# Altium schematic sheet Sheet2.SchDoc
size A3; SheetNumber: 2; SheetTotal: 2
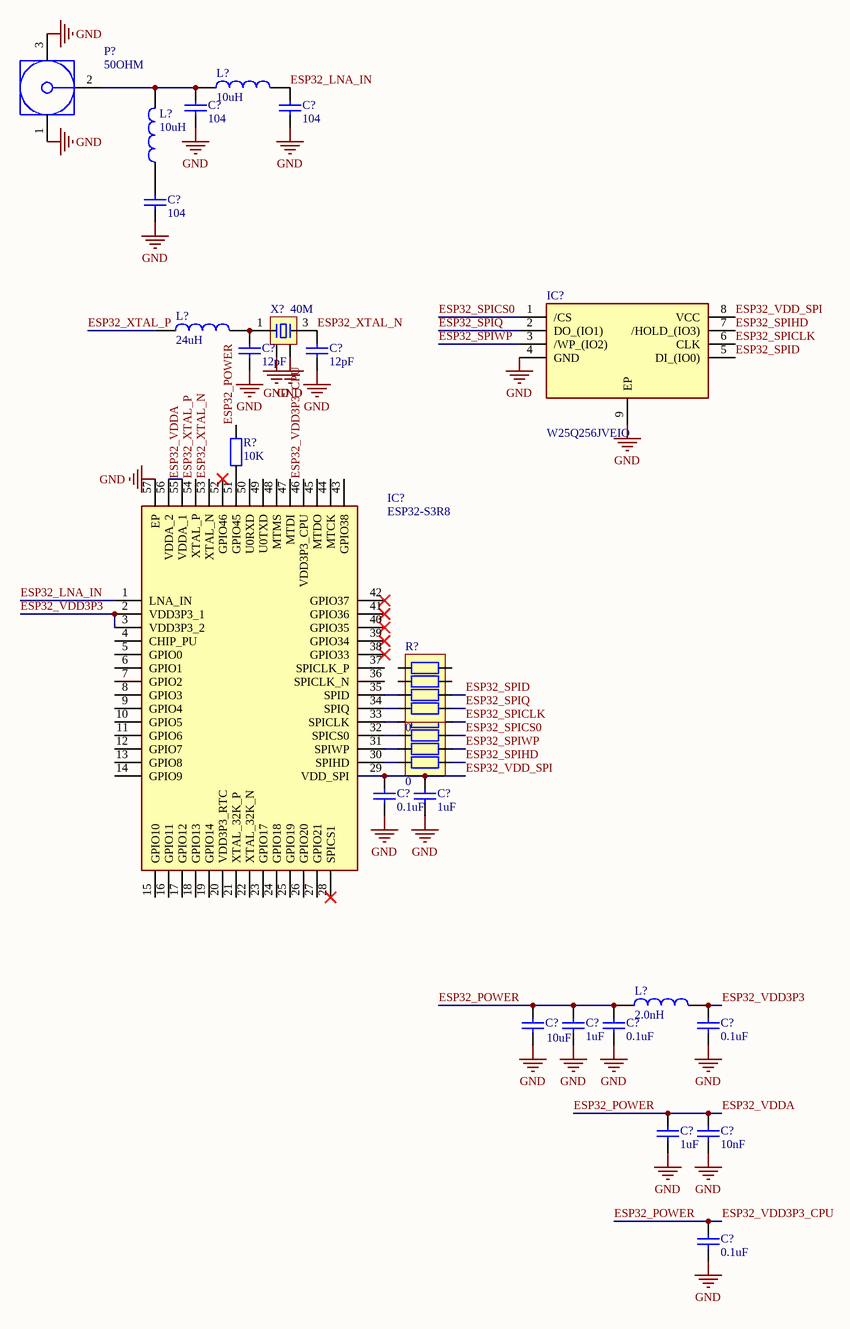
[diagram p0: Sheet2.SchDoc]

## Parts
(Parts that share a designator on the sheet are numbered #1, #2 ... from top to bottom, then left to right.)
C?#1  104  [C0603_L]
C?#2  104  [C0603_L]
C?#3  104  [C0603_L]
C?#4  12pF  [C0603_L]
C?#5  12pF  [C0603_L]
C?#6  0.1uF  [C0603_L]
C?#7  1uF  [C0603_L]
C?#8  10uF  [C0603_L]
C?#9  1uF  [C0603_L]
C?#10  0.1uF  [C0603_L]
C?#11  0.1uF  [C0603_L]
C?#12  1uF  [C0603_L]
C?#13  10nF  [C0603_L]
C?#14  0.1uF  [C0603_L]
IC?#1  W25Q256JVEIQ  [SON127P800X600X80-9N-D]
IC?#2  ESP32-S3R8  [QFN40P700X700X90-57N-D]
L?#1  10uH  [L0603]
L?#2  10uH  [L0603]
L?#3  24uH  [L0603]
L?#4  2.0nH  [L0603]
P?  50OHM  [IPEX]
R?#1  10K  [R0603_L]
R?#2  0  [RCA-8P4R-0402]
R?#3  0  [RCA-8P4R-0402]
X?  40M  [XTAL-3225-4P]

## Nets
GND: C?#1.1 C?#2.1 C?#3.1 C?#4.1 C?#5.1 C?#6.1 C?#7.1 C?#8.1 C?#9.1 C?#10.1 C?#11.1 C?#12.1 C?#13.1 C?#14.1 IC?#1.4(GND) IC?#1.9(EP) IC?#2.57(EP) P?.1 P?.3 X?.2 X?.4
ESP32_LNA_IN: C?#2.2 IC?#2.1(LNA_IN) L?#1.2
ESP32_POWER: C?#8.2 C?#9.2 C?#10.2 C?#12.2 C?#13.2 C?#14.2 IC?#2.46(VDD3P3_CPU) IC?#2.55(VDDA_1) IC?#2.56(VDDA_2) L?#4.1 R?#1.2  [also labelled ESP32_VDD3P3_CPU, ESP32_VDDA]
ESP32_SPICLK: IC?#1.6(CLK) R?#3.8
ESP32_SPICS0: IC?#1.1(/CS) R?#3.7
ESP32_SPID: IC?#1.5(DI_(IO0)) R?#2.6
ESP32_SPIHD: IC?#1.7(/HOLD_(IO3)) R?#3.5
ESP32_SPIQ: IC?#1.2(DO_(IO1)) R?#2.5
ESP32_SPIWP: IC?#1.3(/WP_(IO2)) R?#3.6
ESP32_VDD3P3: C?#11.2 IC?#2.2(VDD3P3_1) IC?#2.3(VDD3P3_2) L?#4.2
ESP32_VDD_SPI: C?#6.2 C?#7.2 IC?#1.8(VCC) IC?#2.29(VDD_SPI)
ESP32_XTAL_N: C?#5.2 IC?#2.53(XTAL_N) X?.3
ESP32_XTAL_P: IC?#2.54(XTAL_P) L?#3.1
NetC?#1_2: C?#1.2 L?#1.1 L?#2.2 P?.2
NetC?#3_2: C?#3.2 L?#2.1
NetC?#4_2: C?#4.2 L?#3.2 X?.1
NetIC?#2_30: IC?#2.30(SPIHD) R?#3.4
NetIC?#2_31: IC?#2.31(SPIWP) R?#3.3
NetIC?#2_32: IC?#2.32(SPICS0) R?#3.2
NetIC?#2_33: IC?#2.33(SPICLK) R?#3.1
NetIC?#2_34: IC?#2.34(SPIQ) R?#2.4
NetIC?#2_35: IC?#2.35(SPID) R?#2.3
NetIC?#2_51: IC?#2.51(GPIO45) R?#1.1

Not connected (* = marked no-connect by the designer): IC?#2 4(CHIP_PU) 5(GPIO0) 6(GPIO1) 7(GPIO2) 8(GPIO3) 9(GPIO4) 10(GPIO5) 11(GPIO6) 12(GPIO7) 13(GPIO8) 14(GPIO9) 15(GPIO10) 16(GPIO11) 17(GPIO12) 18(GPIO13) 19(GPIO14) 20(VDD3P3_RTC) 21(XTAL_32K_P) 22(XTAL_32K_N) 23(GPIO17) 24(GPIO18) 25(GPIO19) 26(GPIO20) 27(GPIO21) 28(SPICS1)* 36(SPICLK_N) 37(SPICLK_P) 38(GPIO33)* 39(GPIO34)* 40(GPIO35)* 41(GPIO36)* 42(GPIO37)* 43(GPIO38) 44(MTCK) 45(MTDO) 47(MTDI) 48(MTMS) 49(U0TXD) 50(U0RXD) 52(GPIO46)*; R?#2 1 2 7 8

## Library data of the parts
C?#1-C?#14 = C: 贴片电容; BOM名称: 无极性贴片电容; 联系卖家，免费查找封装: 唯一出售店铺网址https://shop463601444.taobao.com
IC?#1 = W25Q256JVEIQ: Integrated Circuit; Manufacturer_Name: Winbond; Datasheet Link: https://www.winbond.com/hq/search-resource-file.jsp?partNo=W25Q256JVEIQ&type=datasheet; Height: 0.8mm; Manufacturer_Part_Number: W25Q256JVEIQ; Mouser Part Number: 454-W25Q256JVEIQ; Mouser Price/Stock: https://www.mouser.co.uk/ProductDetail/Winbond/W25Q256JVEIQ?qs=qSfuJ%252Bfl%2Fd4o%2FNFUf7yCgA%3D%3D; Arrow Part Number: W25Q256JVEIQ; Arrow Price/Stock: https://www.arrow.com/en/products/w25q256jveiq/winbond-electronics?region=nac
IC?#2 = ESP32-S3R2: Integrated Circuit; Manufacturer_Name: Espressif Systems; Datasheet Link: https://www.mouser.com/datasheet/2/891/Espressif_Systems_ESP32_S3_Datasheet-2888558.pdf; Height: 0.9mm; Manufacturer_Part_Number: ESP32-S3R2; Mouser Part Number: 356-ESP32-S3R2; Mouser Price/Stock: https://www.mouser.co.uk/ProductDetail/Espressif-Systems/ESP32-S3R2?qs=Rp5uXu7WBW%252B6sJlr%252BvMJKQ%3D%3D
L?#1-L?#4 = L: 贴片小功率电感; BOM名称: 小功率贴片电感; 联系卖家，免费查找封装: 唯一出售店铺网址https://shop463601444.taobao.com
P? = IPEX: RF Coaxial PCB Connector, MCX; Thru-Hole, Right-Angle Mount Socket, Blunt Post Terminal, 50 Ohm Impedance; PCB_Layout: Complies with manufacturer's recommendation.; DrillSize: Corresponds to nominal value.; Published: 15-Jul-2004; LatestRevisionDate: 15-Jul-2004; LatestRevisionNote: Component Replaced.; DatasheetDocument: 30-May-2003; PackageDocument: 04-Jul-1999; PackageReference: 919-119J-51AX; Publisher: Altium Limited; ComponentLink1Description: Manufacturer Link; ComponentLink1URL: http://www.amphenolrf.com/
R?#1 = R: 贴片电阻; 联系卖家，免费查找封装: 唯一出售店铺网址https://shop463601444.taobao.com; BOM名称: 贴片电阻
R?#2 R?#3 = R-8P4R: 贴片4P排阻; BOM名称: 贴片网络排阻; 联系卖家，免费查找封装: 唯一出售店铺网址https://shop463601444.taobao.com
X? = XTAL-4P: 4脚无源晶振(谐振器）; 联系卖家，免费查找封装: 唯一出售店铺网址https://shop463601444.taobao.com; BOM名称: 4脚无源晶振(谐振器）